# Altium schematic sheet MS5611.SchDoc
size A4
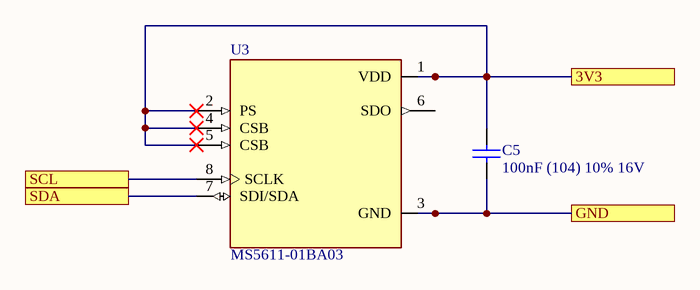
[diagram p0: MS5611.SchDoc]

## Parts
C5  100nF (104) 10% 16V  [0402_C]
U3  MS5611-01BA03  [SON125P500X300X100-8N]

## Ports
3V3, GND, SCL, SDA

## Nets
3V3: C5.2 U3.1(VDD) U3.2(PS) U3.4(CSB) U3.5(CSB) ; port 3V3
GND: C5.1 U3.3(GND) ; port GND
SCL: U3.8(SCLK) ; port SCL
SDA: U3.7(SDI/SDA) ; port SDA

Not connected (* = marked no-connect by the designer): U3 6(SDO)

## Library data of the parts
C5 = 0402 100nF (104) 10% 16V: 贴片电容; ComponentLink1Description: 供应商链接; ComponentLink1URL: http://www.szlcsc.com/product/details_1877.html; Package: 0402; Supplier: LC; SuppliersPartNumber: C1525
U3 = MS5611-01BA03: Pressure Sensor 0.15PSI ~ 17.4PSI _1kPa ~ 120kPa_ Absolute 24 b 8-SMD; MF: TE Connectivity; Price: None; Availability: Unavailable; TE_purchase_URL: https://www.te.com/usa-en/product-MS5611-01BA03.html?te_bu=Cor&te_type=disp&te_campaign=seda_glo_cor-seda-global-disp-prtnr-fy19-seda-model-bom-cta_sma-317_1&elqCampaignId=32493; Value: *; MP: MS5611-01BA03; SnapEDA_Link: https://www.snapeda.com/parts/MS5611-01BA03/TE%20Connectivity%20ALCOSWITCH%20Switches/view-part/2889268/?ref=snap; Package: SMD-8 TE Connectivity